# EAGLE schematic SCH (EAGLE 7.2.0)
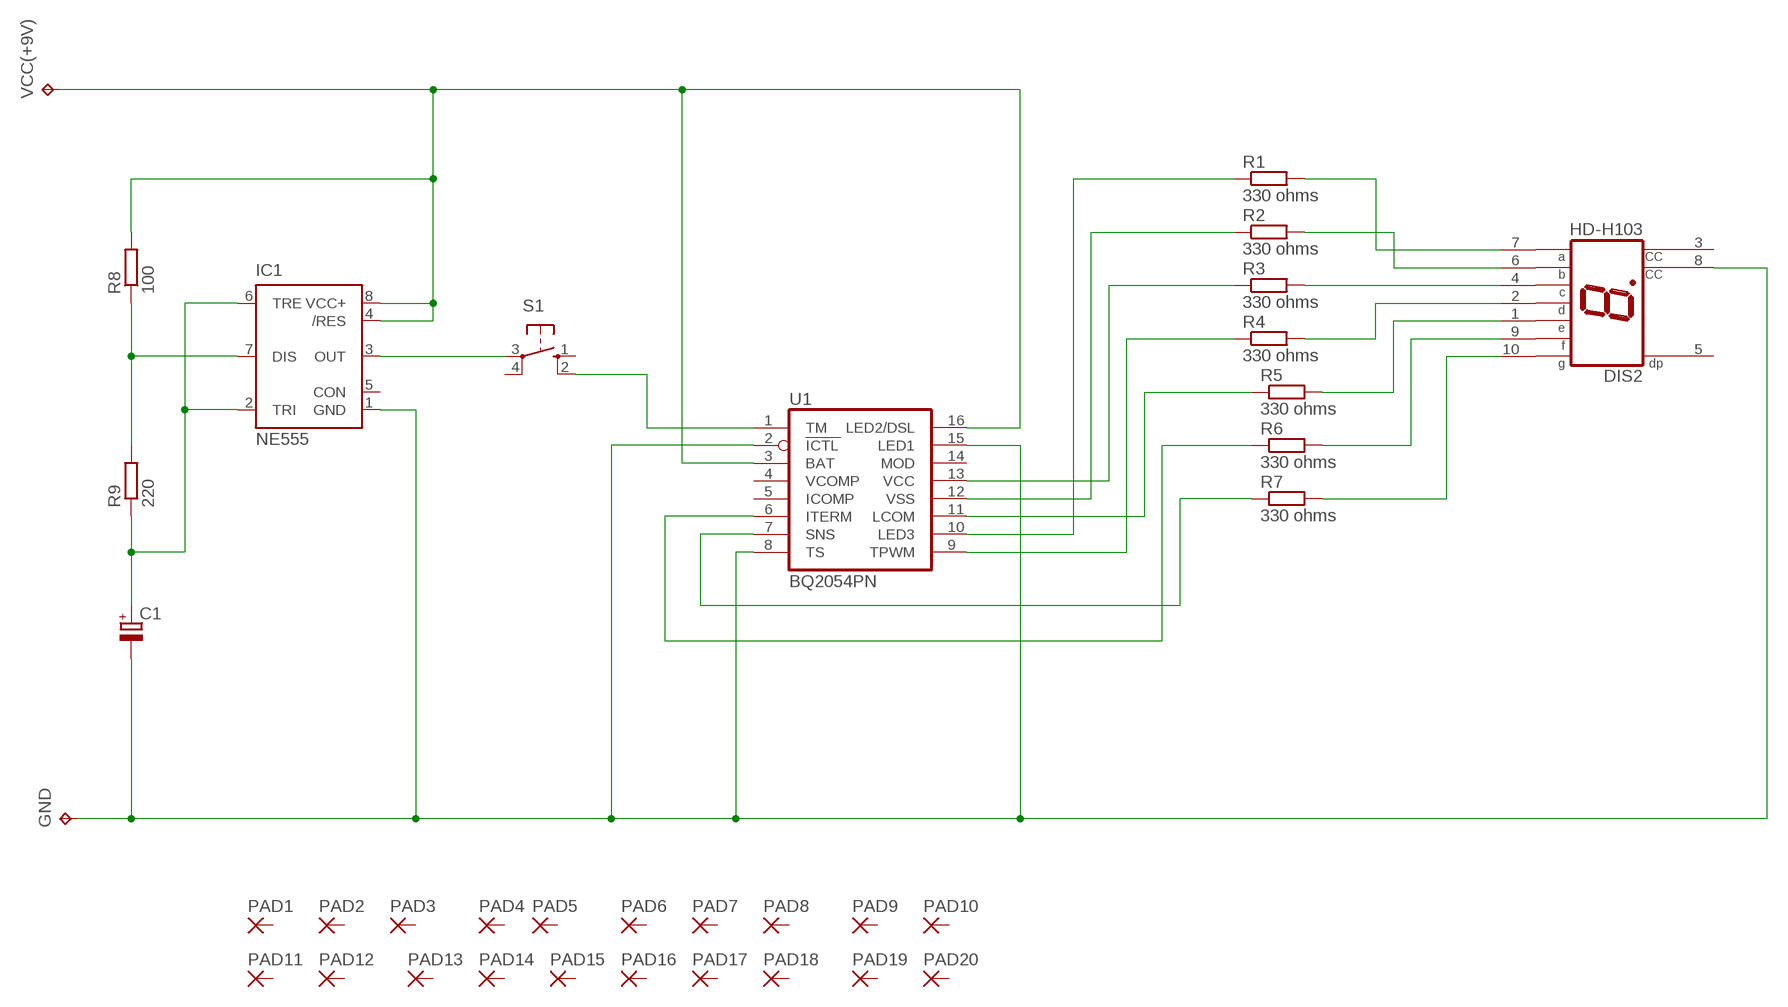
[diagram p0: schematic, sheet 1]

## Parts
C1  CPOL-EUB45181B  [B45181B]
DIS2  HD-H103  [HDSP-M]
GND  TPPAD1-13Y  [P1-13Y]
IC1  NE555  [DIL-08]
PAD1  2,54/0,8  [2,54/0,8]
PAD2  2,54/0,8  [2,54/0,8]
PAD3  2,54/0,8  [2,54/0,8]
PAD4  2,54/0,8  [2,54/0,8]
PAD5  2,54/0,8  [2,54/0,8]
PAD6  2,54/0,8  [2,54/0,8]
PAD7  2,54/0,8  [2,54/0,8]
PAD8  2,54/0,8  [2,54/0,8]
PAD9  2,54/0,8  [2,54/0,8]
PAD10  2,54/0,8  [2,54/0,8]
PAD11  2,54/0,8  [2,54/0,8]
PAD12  2,54/0,8  [2,54/0,8]
PAD13  2,54/0,8  [2,54/0,8]
PAD14  2,54/0,8  [2,54/0,8]
PAD15  2,54/0,8  [2,54/0,8]
PAD16  2,54/0,8  [2,54/0,8]
PAD17  2,54/0,8  [2,54/0,8]
PAD18  2,54/0,8  [2,54/0,8]
PAD19  2,54/0,8  [2,54/0,8]
PAD20  2,54/0,8  [2,54/0,8]
R1  330 ohms  R-EU_0207/10  [0207/10]
R2  330 ohms  R-EU_0207/10  [0207/10]
R3  330 ohms  R-EU_0207/10  [0207/10]
R4  330 ohms  R-EU_0207/10  [0207/10]
R5  330 ohms  R-EU_0207/10  [0207/10]
R6  330 ohms  R-EU_0207/10  [0207/10]
R7  330 ohms  R-EU_0207/10  [0207/10]
R8  100  R-EU_0207/10  [0207/10]
R9  220  R-EU_0207/10  [0207/10]
S1  40-XX  [B3F-40XX]
U1  BQ2054PN  [DIL16]
VCC(+9V)  TPPAD1-13Y  [P1-13Y]

## Nets
N$1: R1.1 U1.10(LED3)
N$2: R2.1 U1.12(VSS)
N$3: R3.1 U1.13(VCC)
N$4: R4.1 U1.9(TPWM)
N$5: R5.1 U1.11(LCOM)
N$6: R6.1 U1.6(ITERM)
N$7: R7.1 U1.7(SNS)
N$8: DIS2.7(A) R1.2
N$9: DIS2.6(B) R2.2
N$10: DIS2.4(C) R3.2
N$11: DIS2.2(D) R4.2
N$12: DIS2.1(E) R5.2
N$13: DIS2.9(F) R6.2
N$14: DIS2.10(G) R7.2
N$15: C1.- DIS2.8(CC) GND.TP IC1.1(GND) U1.2(ICTL) U1.8(TS) U1.15(LED1)
N$16: IC1.4(/RES) IC1.8(VCC+) R8.2 U1.3(BAT) U1.16(LED2/DSL) VCC(+9V).TP
N$17: IC1.7(DIS) R8.1 R9.2
N$18: C1.+ IC1.2(TRI) IC1.6(TRE) R9.1
N$19: IC1.3(OUT) S1.3(P)
N$20: S1.2(S1) U1.1(TM)
Unconnected: DIS2.3(CC) DIS2.5(DP) IC1.5(CON) PAD1.1(P) PAD2.1(P) PAD3.1(P) PAD4.1(P) PAD5.1(P) PAD6.1(P) PAD7.1(P) PAD8.1(P) PAD9.1(P) PAD10.1(P) PAD11.1(P) PAD12.1(P) PAD13.1(P) PAD14.1(P) PAD15.1(P) PAD16.1(P) PAD17.1(P) PAD18.1(P) PAD19.1(P) PAD20.1(P) S1.1(S) S1.4(P1) U1.4(VCOMP) U1.5(ICOMP) U1.14(MOD)

## Library data of the parts
C1 = resistor:CPOL-EU: POLARIZED CAPACITOR, European symbol
DIS2 = display-hp:HD-H103: LED DISPLAY 1-character 7 segment, decimal point right; OC_FARNELL: unknown; OC_NEWARK: unknown
GND VCC(+9V) = testpad:TP: Test pad
IC1 = st-microelectronics:NE555: General purpose bipolar Timer; MF: Arrow Electronics; MPN: NE555N; OC_FARNELL: 1467742; OC_NEWARK: 89K1486
PAD1-PAD20 = wirepad:2,54/0,8: THROUGH-HOLE PAD
R1-R9 = resistor:R-EU_: RESISTOR, European symbol
S1 = switch-omron:40-XX: OMRON SWITCH; MF: OMRON COMPONENTS USA; MPN: B3F-4000; OC_FARNELL: 176434; OC_NEWARK: 36K3105
U1 = texas:BQ2054PN: CHARGE MANAGEMENT IC; MF: TEXAS INSTRUMENT CONNECTORS; MPN: BQ2054PN; OC_FARNELL: 8407789; OC_NEWARK: 74C7582